# Altium schematic sheet Brduino-PwrLin.SchDoc: BRDUINO
size A3; Organization: TDK Micronas; DocumentNumber: tbd; Revision: 0.00.001; SheetNumber: 4; SheetTotal: 4; Date: 8/14/2020; DrawnBy: Moerz; Engineer: Moerz
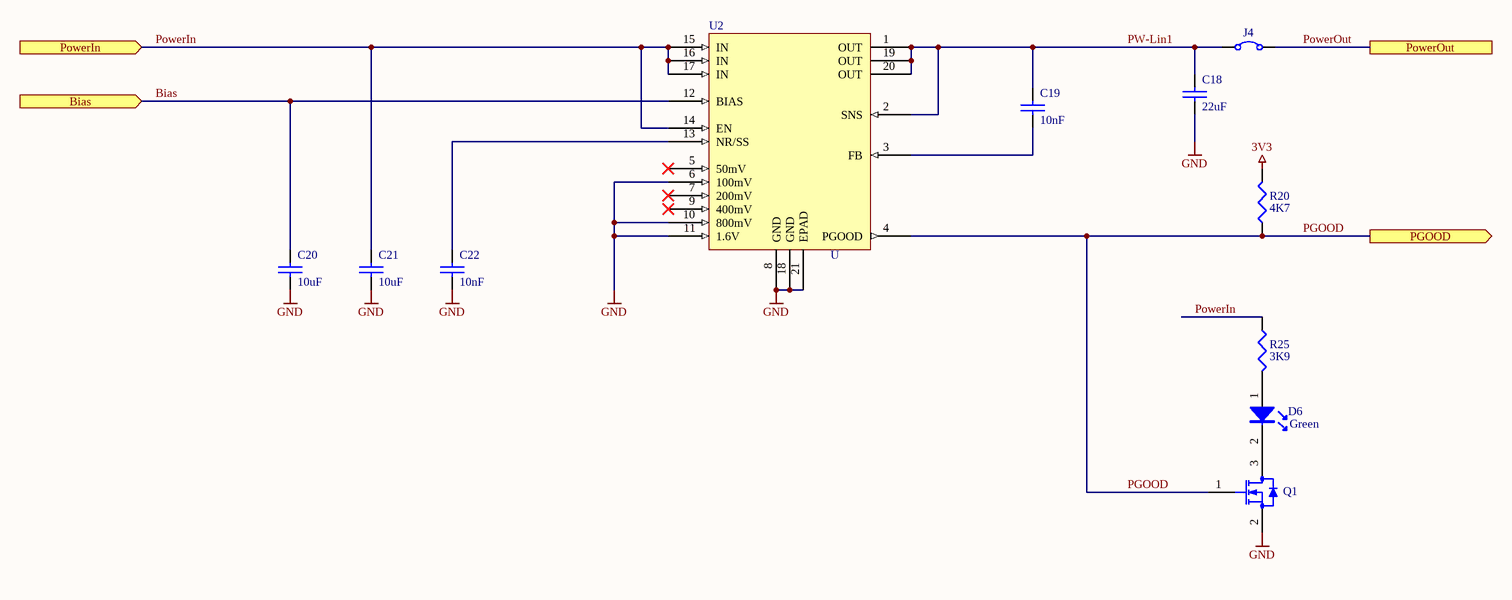
[diagram p0: Brduino-PwrLin.SchDoc]

## Parts
C18  value 22uF  [C0805]  (hidden comment: C)
C19  value 10nF  [C0402]  (hidden comment: C)
C20  value 10uF  [C0805]  (hidden comment: C)
C21  value 10uF  [C0805]  (hidden comment: C)
C22  value 10nF  [C0402]  (hidden comment: C)
D6  value Green  [LED0603]  (hidden comment: D)
J4  R  [JumperSMD]  (value not drawn)
Q1  Q  [SOT323]  (value not drawn)
R20  value 4K7  [R0402]  (hidden comment: R)
R25  value 3K9  [R0402]  (hidden comment: R)
U2  U  [S-PVQFN-N20]

## Ports
Bias (in), PGOOD (out), PowerIn (in), PowerOut

## Nets
3V3: R20.2
GND: C18.1 C20.1 C21.1 C22.2 Q1.2(S) U2.6(100mV) U2.8(GND) U2.10(800mV) U2.11(1.6V) U2.18(GND) U2.21(EPAD)
Bias: C20.2 U2.12(BIAS) ; port Bias
PGOOD: Q1.1(G) R20.1 U2.4(PGOOD) ; port PGOOD
PowerIn: C21.2 R25.1 U2.14(EN) U2.15(IN) U2.16(IN) U2.17(IN) ; port PowerIn
PowerOut: J4.2 ; port PowerOut
PW-Lin1: C18.2 C19.1 J4.1 U2.1(OUT) U2.2(SNS) U2.19(OUT) U2.20(OUT)
NetC19_2: C19.2 U2.3(FB)
NetC22_1: C22.1 U2.13(NR/SS)
NetD6_1: D6.1(A) R25.2
NetD6_2: D6.2(K) Q1.3(D)

Not connected (* = marked no-connect by the designer): U2 5(50mV)* 7(200mV)* 9(400mV)*

## Notes on the sheet
- Title
- Size:
- Date:
- A3
- Number:
- Time:
- Revision:
- Sheet
- of
- R
- Schlossstrasse 50
- D-66352 Karlsbrunn
- Germany
- Engineering GmbH
- ev
- ision
- O
- ne
- File:

## Library data of the parts
C18 = CAP: CAP CER 22UF 10V X5R 0805; 04. Manufacturer: Murata Electronics; 05. Manufacturer PN: GRM21BR61A226ME44#; Parameters: X7R, 25V, 10%; POPULATED: yes; 03. Unit Price: 0.49; 01. Distributor: DigiKey; 02. distributor PN: 490-10746-6-ND
C19 C22 = CAP: CAP CER 10000PF 50V X7R 0402; 04. Manufacturer: Murata Electronics; 05. Manufacturer PN: GRM155R71H103KA88D; POPULATED: yes; Parameters: X7R, 25V, 10%; 03. Unit Price: 0.08; 01. Distributor: DigiKey; 02. distributor PN: 490-4516-6-ND
C20 C21 = CAP: CAP CER 10UF 25V X5R 0805; 04. Manufacturer: Murata Electronics; 05. Manufacturer PN: GRM21BR61E106KA73L; Parameters: X7R, 25V, 10%; POPULATED: yes; 03. Unit Price: 0.37; 01. Distributor: DigiKey; 02. distributor PN: 490-5523-6-ND
D6 = LED: LED GREEN CLEAR 1608 SMD; 04. Manufacturer: KINGBRIGHT; 05. Manufacturer PN: APHD1608LCGCK; POPULATED: yes; Parameters: If >= 2mA; 03. Unit Price: 0.34; 01. Distributor: DigiKey; 02. distributor PN: 754-2031-6-ND
J4 = Jumper: RES SMD 0 OHM JUMPER 1/10W 0603; 04. Manufacturer: Yageo; 05. Manufacturer PN: RC0603JR-070RL; POPULATED: yes; 03. Unit Price: 0.08; Value: 0R; 01. Distributor: DigiKey; 02. distributor PN: 311-0.0GRDKR-ND
Q1 = MOSFET-N-D: MOSFET N-CHANNEL 30V 1A SC70; 04. Manufacturer: NEXPERIA; 05. Manufacturer PN: PMF250XNEX; POPULATED: yes; 03. Unit Price: 0.31; 01. Distributor: DigiKey; 02. distributor PN: 1727-2693-6-ND
R20 = RES1A: RES SMD 4.7K OHM 1% 1/16W 0402; 04. Manufacturer: Yageo; 05. Manufacturer PN: RC0402FR-074K7L; POPULATED: yes; Parameters: 1/16W, 50V, 1%; 03. Unit Price: 0.08; 01. Distributor: DigiKey; 02. distributor PN: 311-4.7KLRDKR-ND
R25 = RES1A: RES SMD 3.9K OHM 1% 1/16W 0402; 04. Manufacturer: Yageo; 05. Manufacturer PN: RC0402FR-073K9L; POPULATED: yes; Parameters: 1/16W, 50V, 1%; 03. Unit Price: 0.08; 01. Distributor: DigiKey; 02. distributor PN: 311-3.90KLRDKR-ND
U2 = TPS7A8300: IC REG LINEAR POS ADJ 2A 20VQFN; 04. Manufacturer: Texas Instruments; 05. Manufacturer PN: TPS7A8300RGWT; POPULATED: yes; 03. Unit Price: 4.57; 01. Distributor: DigiKey; 02. distributor PN: 296-36510-6-ND